# Altium schematic sheet Reflectance (Single).SchDoc
size A4; SheetNumber: 6; SheetTotal: 6
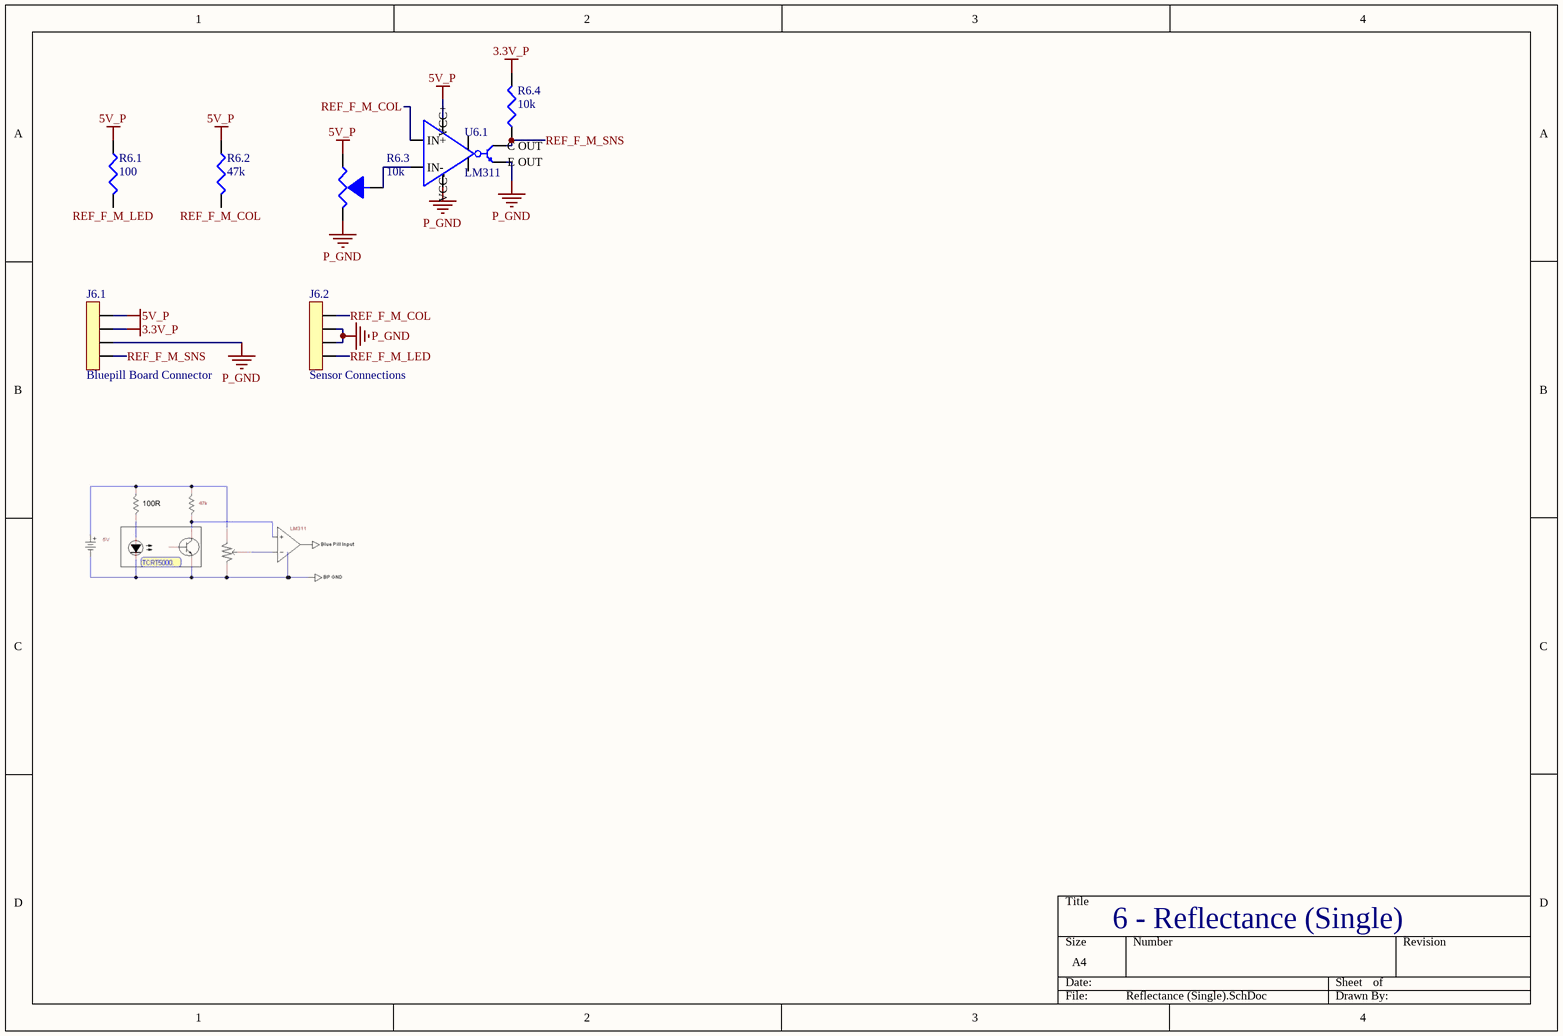
[diagram p0: Reflectance (Single).SchDoc]

## Parts
J6.1  Bluepill Board Connector  [4Pos JST]
J6.2  Sensor Connections  [4Pos JST]
R6.1  100  [Res_Generic]
R6.2  47k  [Res_Generic]
R6.3  10k  [Pot Generic]
R6.4  10k  [Res_Generic]
U6.1  LM311  [DIP8]

## Nets
3.3V_P: J6.1.3 R6.4.2
5V_P: J6.1.4 R6.1.1 R6.2.1 R6.3.3 U6.1.8(VCC+)
P_GND: J6.1.2 J6.2.2 J6.2.3 R6.3.1 U6.1.1(E_OUT) U6.1.4(VCC-)
REF_F_M_COL: J6.2.4 R6.2.2 U6.1.2(IN+)
REF_F_M_LED: J6.2.1 R6.1.2
REF_F_M_SNS: J6.1.1 R6.4.1 U6.1.7(C_OUT)
NetR6.3_2: R6.3.2 U6.1.3(IN-)

Not connected (* = marked no-connect by the designer): U6.1 5(BAL) 6(STRB)

## Notes on the sheet
- 6 - Reflectance (Single)

## Library data of the parts
J6.1 J6.2 = 4pos Conn
R6.1 R6.2 R6.4 = Res_Generic
R6.3 = Pot_Generic
U6.1 = LM311 Comparator: LM311 IC DIFF COMPARATOR STROBE 8-DIP; Supplier 1: Mouser; Supplier Part Number 1: 595-LM311P